# EAGLE design Uzebox Game Console Omega (EAGLE 9.6.2)
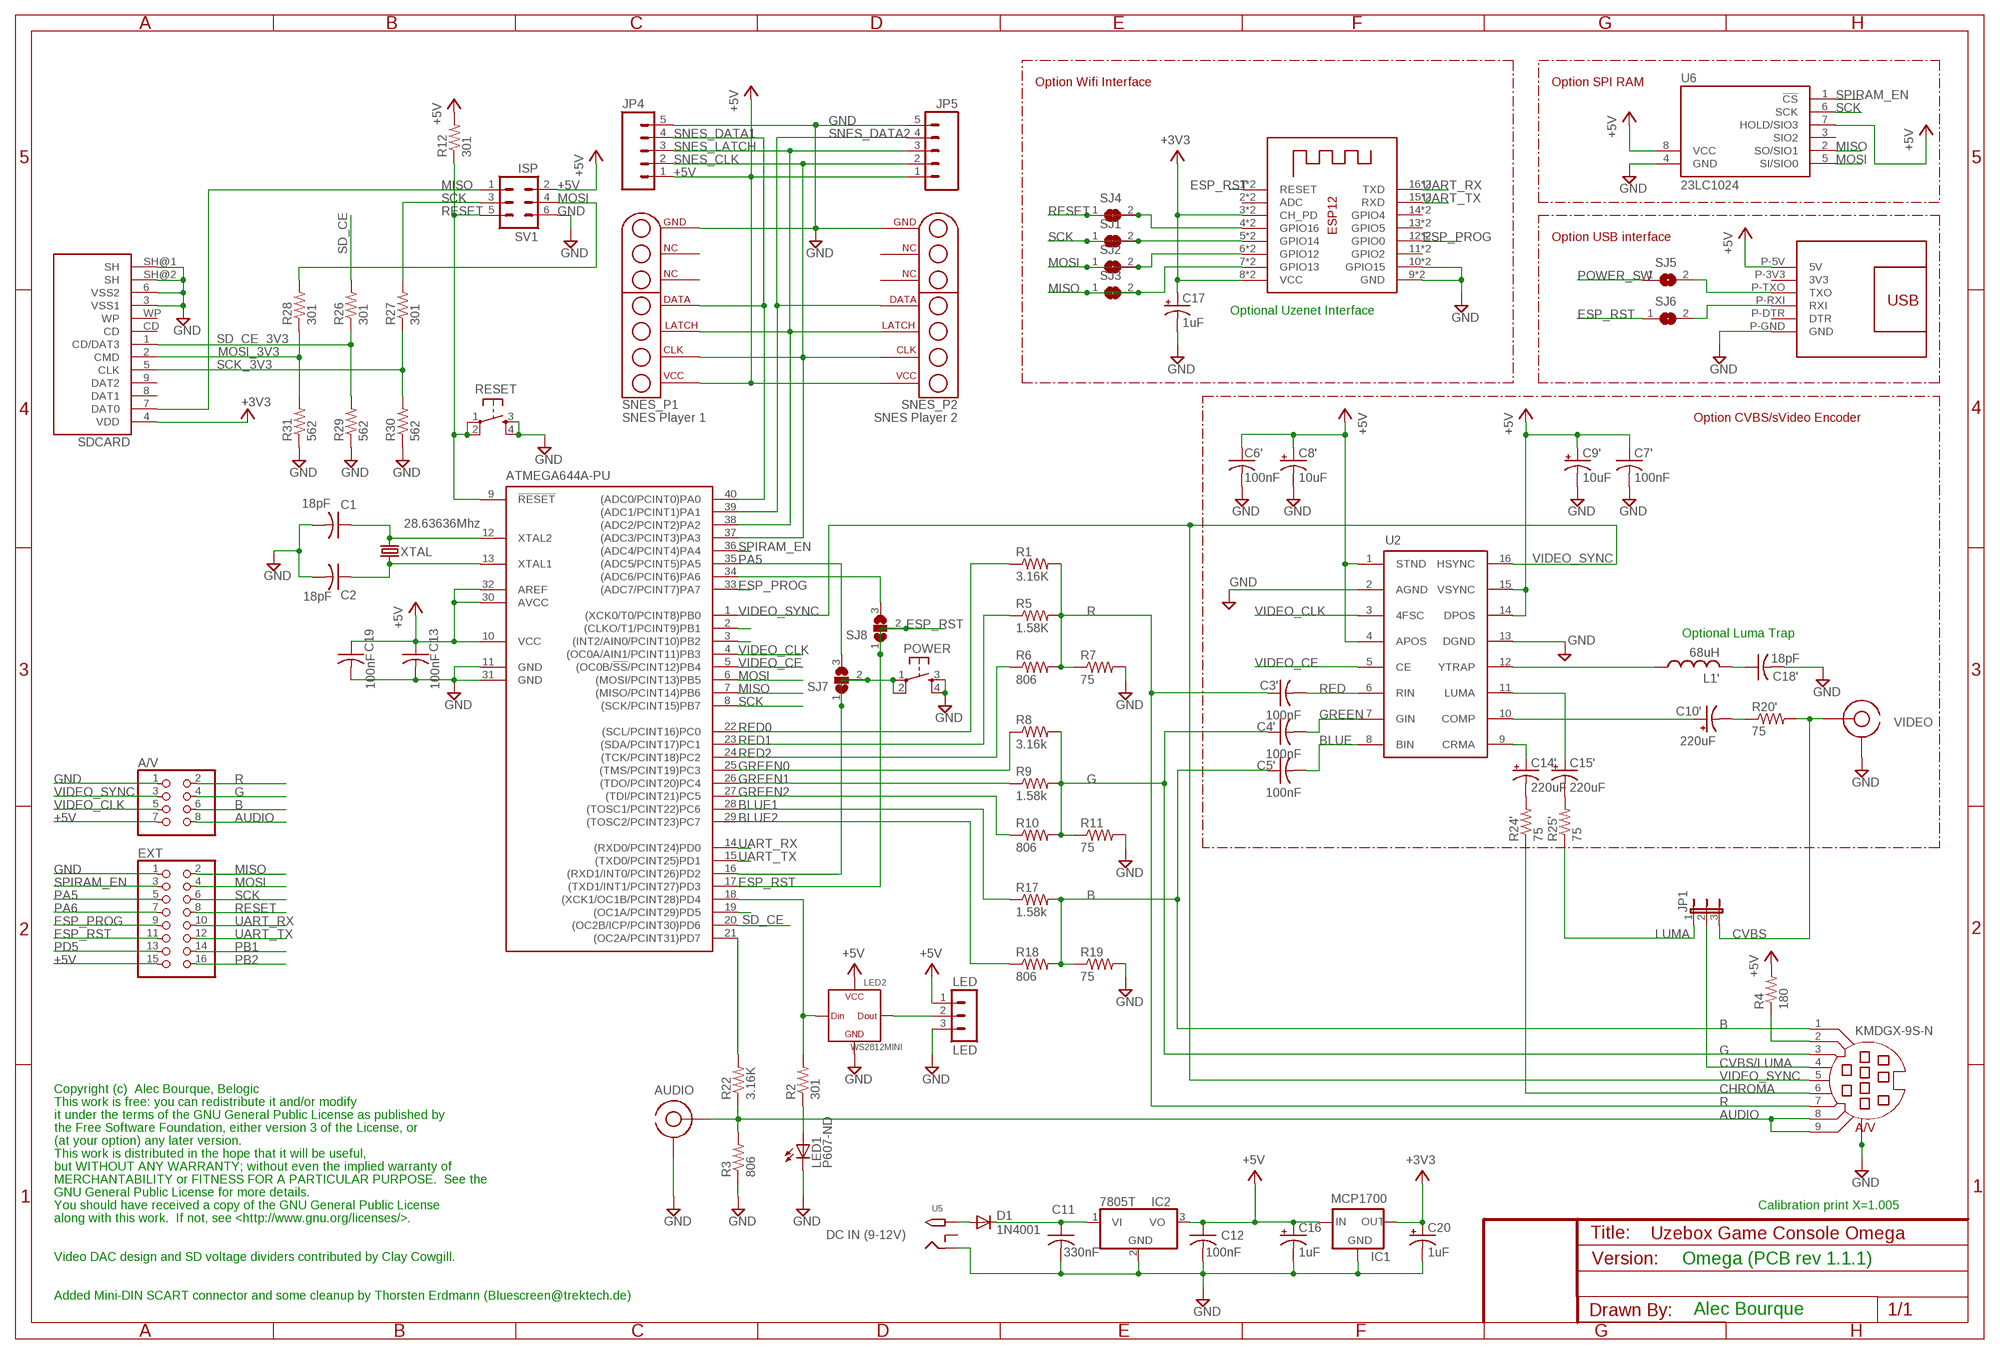
[diagram p0: schematic, sheet 1]

## Parts
A/V  PINHD-2X4  [2X04]
AD725  AD725  [SO16W]
ATMEGA644A-PU  MEGA164P/324P/644P-PU  [DIL40]
AUDIO  RCA  [RCA]
C1  18pF  C-US025-025X050  [C025-025X050]
C2  18pF  C-US025-025X050  [C025-025X050]
C3'  100nF  C-US025-025X050  [C025-025X050]
C4'  100nF  C-US025-025X050  [C025-025X050]
C5'  100nF  C-US025-025X050  [C025-025X050]
C6'  100nF  C-US025-025X050  [C025-025X050]
C7'  100nF  C-US025-025X050  [C025-025X050]
C8'  10uF  CPOL-USE2.5-6  [E2,5-6]
C9'  10uF  CPOL-USE2.5-6  [E2,5-6]
C10'  220uF  CPOL-USE2.5-6  [E2,5-6]
C11  330nF  C-US025-025X050  [C025-025X050]
C12  100nF  C-US025-025X050  [C025-025X050]
C13  100nF  C-US025-025X050  [C025-025X050]
C14'  220uF  CPOL-USE2.5-6  [E2,5-6]
C15'  220uF  CPOL-USE2.5-6  [E2,5-6]
C16  1uF  CPOL-USE2.5-6  [E2,5-6]
C17  1uF  CPOL-USE2-4  [E2-4]
C18'  18pF  C-US025-025X050  [C025-025X050]
C19  100nF  C-US025-025X050  [C025-025X050]
C20  1uF  CPOL-USE2.5-6  [E2,5-6]
CON1  USBSERIALSMD  [USBSERIAL_SMD]
D1  1N4001  1N4004  [DO41-10]
ESP-12  ESP-12  UZEBOX_ESP-12TROUGH_HOLE  [UZEBOX_ESP-12_TH]
EXT  PINHD-2X8  [2X08]
IC1  MCP1700  MCP1700INLINE  [TO92-INLINE]
IC2  7805T  [TO220H]
JP1  JP2E  [JP2]
JP4  M05PTH  [1X05]
JP5  M05PTH  [1X05]
KMDGX-9S-N  A/V  MINI-DIN-9  [MINI-DIN-9]
L1'  68uH  L-US6000-XXX-RC  [6000-XXXX-RC]
LED  LED  PINHEAD1X3  [PINHEAD1X3]
LED1  P607-ND  LED3MM  [LED3MM]
LED2  WS2812MINI  [RGB3535]
POWER  USER  TAC_SWITCHPTH  [TACTILE-PTH]
R1  3.16K  R-US_0207/10  [0207/10]
R2  301  R-US_0207/10  [0207/10]
R3  806  R-US_0207/10  [0207/10]
R4  180  R-US_0207/10  [0207/10]
R5  1.58K  R-US_0207/10  [0207/10]
R6  806  R-US_0207/10  [0207/10]
R7  75  R-US_0207/10  [0207/10]
R8  3.16k  R-US_0207/10  [0207/10]
R9  1.58k  R-US_0207/10  [0207/10]
R10  806  R-US_0207/10  [0207/10]
R11  75  R-US_0207/10  [0207/10]
R12  301  R-US_0207/10  [0207/10]
R17  1.58k  R-US_0207/10  [0207/10]
R18  806  R-US_0207/10  [0207/10]
R19  75  R-US_0207/10  [0207/10]
R20'  75  R-US_0207/10  [0207/10]
R22  3.16K  R-US_0207/10  [0207/10]
R24'  75  R-US_0207/10  [0207/10]
R25'  75  R-US_0207/10  [0207/10]
R26  301  R-US_0207/10  [0207/10]
R27  301  R-US_0207/10  [0207/10]
R28  301  R-US_0207/10  [0207/10]
R29  562  R-US_0207/10  [0207/10]
R30  562  R-US_0207/10  [0207/10]
R31  562  R-US_0207/10  [0207/10]
RESET  RESET  TAC_SWITCHPTH  [TACTILE-PTH]
SDCARD  SD_CARD_SOCKET4UCON  [SDCARD_4UCONN]
SJ1  SJ  [SJ]
SJ2  SJ  [SJ]
SJ3  SJ  [SJ]
SJ4  SJ  [SJ]
SJ5  SJ  [SJ]
SJ6  SJ  [SJ]
SJ7  SJ2W  [SJ_2]
SJ8  SJ2W  [SJ_2]
SNES_P1  SNES Player 1  SNES_CONNECTOR  [SNES_CONNECTOR]
SNES_P2  SNES Player 2  SNES_CONNECTOR  [SNES_CONNECTOR]
SV1  ISP  ML6L  [ML6L]
U5  DC IN  2.1MMJACKTHM  [PJ-102A]
U6  23LC1024  [DIL08]
VIDEO  RCA  [RCA]
XTAL  28.63636Mhz  CRYSTALHC49S  [HC49/S]

## Nets
+3V3: C17.+ C20.+ ESP-12.3(CH_PD) ESP-12.8(VCC) ESP-12.P$3(CH_PD) ESP-12.P$8(VCC) IC1.3(OUT) SDCARD.4(VDD)
+5V: A/V.7 AD725.1(STND) AD725.4(APOS) AD725.14(DPOS) AD725.15(VSYNC) ATMEGA644A-PU.10(VCC) ATMEGA644A-PU.30(AVCC) ATMEGA644A-PU.32(AREF) C6'.1 C7'.1 C8'.+ C9'.+ C12.1 C13.1 C16.+ C19.1 CON1.P-5V(5V) EXT.15 IC1.2(IN) IC2.3(VO) JP4.1 JP5.1 LED2.VSS(VCC) LED.1 R4.2 R12.2 SNES_P1.P$8(VCC) SNES_P2.P$8(VCC) SV1.2 U6.7(HOLD/SIO3) U6.8(VCC)
AUDIO: A/V.8 AUDIO.SIG KMDGX-9S-N.8 KMDGX-9S-N.9 R3.2 R22.1
B: A/V.6 C5'.1 KMDGX-9S-N.1 R17.2 R18.2 R19.1
BLUE: AD725.8(BIN) C5'.2
BLUE1: ATMEGA644A-PU.28((TOSC1/PCINT22)PC6) R17.1
BLUE2: ATMEGA644A-PU.29((TOSC2/PCINT23)PC7) R18.1
CHROMA: KMDGX-9S-N.6 R24'.1
CVBS: JP1.3 R20'.2 VIDEO.SIG
CVBS/LUMA: JP1.2 KMDGX-9S-N.4
ESP_PROG: ATMEGA644A-PU.33((ADC7/PCINT7)PA7) ESP-12.12(GPIO0) ESP-12.P$12(GPIO0) EXT.9
ESP_RST: ATMEGA644A-PU.17((TXD1/INT1/PCINT27)PD3) ESP-12.1(RESET) ESP-12.P$1(RESET) EXT.11 SJ6.1 SJ8.1 SJ8.2
G: A/V.4 C4'.1 KMDGX-9S-N.3 R8.2 R9.2 R10.2 R11.1
GND: A/V.1 AD725.2(AGND) AD725.13(DGND) ATMEGA644A-PU.11(GND) ATMEGA644A-PU.31(GND) AUDIO.GND C1.2 C2.2 C6'.2 C7'.2 C8'.- C9'.- C11.2 C12.2 C13.2 C16.- C17.- C18'.2 C19.2 C20.- CON1.P-GND(GND) ESP-12.9(GND) ESP-12.10(GPIO15) ESP-12.P$9(GND) ESP-12.P$10(GPIO15) EXT.1 IC1.1(GND) IC2.2(GND) JP4.5 JP5.5 KMDGX-9S-N.G1 KMDGX-9S-N.G2 KMDGX-9S-N.G3 LED1.K(C) LED2.VDD(GND) LED.3 POWER.3 POWER.4 R3.1 R7.2 R11.2 R19.2 R29.1 R30.1 R31.1 RESET.3 RESET.4 SDCARD.3(VSS1) SDCARD.6(VSS2) SDCARD.SH@1(SH) SDCARD.SH@2(SH) SNES_P1.P$14(GND) SNES_P2.P$14(GND) SV1.6 U5.RING U6.4(GND) VIDEO.GND
GREEN: AD725.7(GIN) C4'.2
GREEN0: ATMEGA644A-PU.25((TMS/PCINT19)PC3) R8.1
GREEN1: ATMEGA644A-PU.26((TDO/PCINT20)PC4) R9.1
GREEN2: ATMEGA644A-PU.27((TDI/PCINT21)PC5) R10.1
LUMA: JP1.1 R25'.1
MISO: ATMEGA644A-PU.7((MISO/PCINT14)PB6) ESP-12.7(GPIO13) ESP-12.P$7(GPIO13) EXT.2 SDCARD.7(DAT0) SJ3.1 SJ3.2 SV1.1 U6.2(SO/SIO1)
MOSI: ATMEGA644A-PU.6((MOSI/PCINT13)PB5) ESP-12.6(GPIO12) ESP-12.P$6(GPIO12) EXT.4 R28.2 SJ2.1 SJ2.2 SV1.4 U6.5(SI/SIO0)
MOSI_3V3: R28.1 R31.2 SDCARD.2(CMD)
N$1: AD725.12(YTRAP) L1'.1
N$2: C18'.1 L1'.2
N$3: CON1.P-TXO(TXO) SJ5.2
N$4: CON1.P-RXI(RXI) SJ6.2
N$5: LED2.DOUT LED.2
N$6: C10'.- R20'.1
N$7: AD725.10(COMP) C10'.+
N$9: ATMEGA644A-PU.12(XTAL2) C1.1 XTAL.2
N$10: D1.A U5.TIP
N$11: C14'.- R24'.2
N$12: ATMEGA644A-PU.13(XTAL1) C2.1 XTAL.1
N$13: ATMEGA644A-PU.21((OC2A/PCINT31)PD7) R22.2
N$15: KMDGX-9S-N.2 R4.1
N$20: C11.1 D1.C IC2.1(VI)
N$23: ATMEGA644A-PU.18((XCK1/OC1B/PCINT28)PD4) LED2.DIN R2.2
N$25: LED1.A R2.1
N$26: C15'.- R25'.2
N$28: AD725.11(LUMA) C15'.+
N$29: AD725.9(CRMA) C14'.+
PA5: ATMEGA644A-PU.35((ADC5/PCINT5)PA5) EXT.5 SJ7.3
PA6: ATMEGA644A-PU.34((ADC6/PCINT6)PA6) EXT.7 SJ8.3
PB1: ATMEGA644A-PU.2((CLKO/T1/PCINT9)PB1) EXT.14
PB2: ATMEGA644A-PU.3((INT2/AIN0/PCINT10)PB2) EXT.16
PD5: ATMEGA644A-PU.19((OC1A/PCINT29)PD5) EXT.13
POWER_SW: ATMEGA644A-PU.16((RXD1/INT0/PCINT26)PD2) POWER.1 POWER.2 SJ5.1 SJ7.1 SJ7.2
R: A/V.2 C3'.1 KMDGX-9S-N.7 R1.2 R5.2 R6.2 R7.1
RED: AD725.6(RIN) C3'.2
RED0: ATMEGA644A-PU.22((SCL/PCINT16)PC0) R1.1
RED1: ATMEGA644A-PU.23((SDA/PCINT17)PC1) R5.1
RED2: ATMEGA644A-PU.24((TCK/PCINT18)PC2) R6.1
RESET: ATMEGA644A-PU.9(!RESET) ESP-12.4(GPIO16) ESP-12.P$4(GPIO16) EXT.8 R12.1 RESET.1 RESET.2 SJ4.1 SJ4.2 SV1.5
SCK: ATMEGA644A-PU.8((SCK/PCINT15)PB7) ESP-12.5(GPIO14) ESP-12.P$5(GPIO14) EXT.6 R27.2 SJ1.1 SJ1.2 SV1.3 U6.6(SCK)
SCK_3V3: R27.1 R30.2 SDCARD.5(CLK)
SD_CE: ATMEGA644A-PU.20((OC2B/ICP/PCINT30)PD6) R26.2
SD_CE_3V3: R26.1 R29.2 SDCARD.1(CD/DAT3)
SNES_CLK: ATMEGA644A-PU.37((ADC3/PCINT3)PA3) JP4.2 JP5.2 SNES_P1.P$9(CLK) SNES_P2.P$9(CLK)
SNES_DATA1: ATMEGA644A-PU.40((ADC0/PCINT0)PA0) JP4.4 SNES_P1.P$11(DATA)
SNES_DATA2: ATMEGA644A-PU.39((ADC1/PCINT1)PA1) JP5.4 SNES_P2.P$11(DATA)
SNES_LATCH: ATMEGA644A-PU.38((ADC2/PCINT2)PA2) JP4.3 JP5.3 SNES_P1.P$10(LATCH) SNES_P2.P$10(LATCH)
SPIRAM_EN: ATMEGA644A-PU.36((ADC4/PCINT4)PA4) EXT.3 U6.1(!CS)
UART_RX: ATMEGA644A-PU.14((RXD0/PCINT24)PD0) ESP-12.16(TXD) ESP-12.P$16(TXD) EXT.10
UART_TX: ATMEGA644A-PU.15((TXD0/PCINT25)PD1) ESP-12.15(RXD) ESP-12.P$15(RXD) EXT.12
VIDEO_CE: AD725.5(CE) ATMEGA644A-PU.5((OC0B/!SS!/PCINT12)PB4)
VIDEO_CLK: A/V.5 AD725.3(4FSC) ATMEGA644A-PU.4((OC0A/AIN1/PCINT11)PB3)
VIDEO_SYNC: A/V.3 AD725.16(HSYNC) ATMEGA644A-PU.1((XCK0/T0/PCINT8)PB0) KMDGX-9S-N.5
Unconnected: CON1.P-3V3(3V3) CON1.P-DTR(DTR) ESP-12.2(ADC) ESP-12.11(GPIO2) ESP-12.13(GPIO5) ESP-12.14(GPIO4) ESP-12.P$2(ADC) ESP-12.P$11(GPIO2) ESP-12.P$13(GPIO5) ESP-12.P$14(GPIO4) SDCARD.8(DAT1) SDCARD.9(DAT2) SDCARD.CD SDCARD.WP SNES_P1.P$12(NC1) SNES_P1.P$13(NC2) SNES_P2.P$12(NC1) SNES_P2.P$13(NC2) U5.RING_SW U6.3(SIO2)

## Notes on the sheet
- Option Wifi Interface | Option SPI RAM
- Option USB interface
- Optional Uzenet Interface
- Option CVBS/sVideo Encoder
- Optional Luma Trap
- Copyright (c)  Alec Bourque, Belogic
- This work is free: you can redistribute it and/or modify
- it under the terms of the GNU General Public License as published by
- the Free Software Foundation, either version 3 of the License, or
- (at your option) any later version.
- This work is distributed in the hope that it will be useful,
- but WITHOUT ANY WARRANTY; without even the implied warranty of
- MERCHANTABILITY or FITNESS FOR A PARTICULAR PURPOSE.  See the
- GNU General Public License for more details.
- You should have received a copy of the GNU General Public License | Calibration print X=1.005
- along with this work.  If not, see <http://www.gnu.org/licenses/>.
- Video DAC design and SD voltage dividers contributed by Clay Cowgill.
- Omega (PCB rev 1.1.1)
- Added Mini-DIN SCART connector and some cleanup by Thorsten Erdmann (Bluescreen@trektech.de)
- Alec Bourque

## Library data of the parts
A/V = pinhead:PINHD-2X4: PIN HEADER
AD725 = ad725:AD725; IC_NO: U2
ATMEGA644A-PU = avr-5:MEGA164P/324P/644P-PU
AUDIO = rca:RCA: RCA jack; PN: CP-1420-ND
C1 C2 C6' C7' C11-C13 C18' C19 = resistor:C-US: CAPACITOR, American symbol
C3' C4' C5' = rcl:C-US: CAPACITOR, American symbol; SPICEPREFIX: C
C8' C9' C10' C14' C15' C16 C20 = rcl:CPOL-US: POLARIZED CAPACITOR, American symbol; SPICEPREFIX: C
C17 = adafruit:CPOL-US: POLARIZED CAPACITOR, American symbol
CON1 = Thorsten_diverses:USBSERIAL
D1 = adafruit:1N4004: DIODE General purpose 1N400x type rectifier (With bigger pads) http://www.ladyada.net/library/pcb/eaglelibrary.html; PN: 641-1310-1-ND
ESP-12 = Uzebox Portable V2:UZEBOX_ESP-12
EXT = pinhead:PINHD-2X8: PIN HEADER
IC1 = adafruit:MCP1700: VOLTAGE REGULATOR; DPN: MCP1700-3302E/TO-ND
IC2 = adafruit:78*: Positive VOLTAGE REGULATOR Added bigger pads to the TO-92 package; DPN: LM7805ACT-ND
JP1 = jumper:JP2E: JUMPER
JP4 JP5 = SparkFun:M05: Header 5 Standard 5-pin 0.1" header. Use with straight break away headers (SKU : PRT-00116), right angle break away headers (PRT-00553), swiss pins (PRT-00743), machine pins (PRT-00117), and female headers (PRT-00115). Molex polarized connector foot print use with SKU : PRT-08230 with associated crimp pins and housings.
KMDGX-9S-N = Thorsten_connectors:MINI-DIN-9
L1' = rcl:L-US: INDUCTOR, American symbol; SPICEPREFIX: L
LED = Thorsten_connectors:PINHEAD1X3
LED1 = adafruit:LED: LED OSRAM: - CHIPLED LG R971, LG N971, LY N971, LG Q971, LY Q971, LO R971, LY R971 LH N974, LH R974 LS Q976, LO Q976, LY Q976 LO Q996 - Hyper CHIPLED LW Q18S LB Q993, LB Q99A, LB R99A - SideLED LS A670, LO A670, LY A670, LG A670, LP A670 LB A673, LV A673, LT A673, LW A673 LH A674 LY A675 LS A676, LA A676, LO A676, LY A676, LW A676 LS A679, LY A679, LG A679 - Hyper Micro SIDELED® LS Y876, LA Y876, LO Y876, LY Y876 LT Y87S - SmartLED LW L88C, LW L88S LB L89C, LB L89S, LG L890 LS L89K, LO L89K, LY L89K LS L896, LA L896, LO L896, LY L896 - TOPLED LS T670, LO T670, LY T670, LG T670, LP T670 LSG T670, LSP T670, LSY T670, LOP T670, LYG T670 LG T671, LOG T671, LSG T671 LB T673, LV T673, LT T673, LW T673 LH T674 LS T676, LA T676, LO T676, LY T676, LB T676, LH T676, LSB T676, LW T676 LB T67C, LV T67C, LT T67C, LS T67K, LO T67K, LY T67K, LW E67C LS E67B, LA E67B, LO E67B, LY E67B, LB E67C, LV E67C, LT E67C LW T67C LS T679, LY T679, LG T679 LS T770, LO T770, LY T770, LG T770, LP T770 LB T773, LV T773, LT T773, LW T773 LH T774 LS E675, LA E675, LY E675, LS T675 LS T776, LA T776, LO T776, LY T776, LB T776 LHGB T686 LT T68C, LB T68C - Hyper Mini TOPLED® LB M676 - Mini TOPLED Santana® LG M470 LS M47K, LO M47K, LY M47K Source: http://www.osram.convergy.de/
LED2 = Thorsten_LEDs:WS2812MINI
POWER RESET = SparkFun:TAC_SWITCH: Momentary Switch Button commonly used for reset or general input. Spark Fun Electronics SKU : COM-00097; PN: P8006S-ND
R1-R12 R17-R19 R20' R22 R24' R25' R26-R31 = resistor:R-US_: RESISTOR, American symbol
SDCARD = SparkFun-Connectors:SD_CARD_SOCKET: SD Memory Card Connector, push-push normal type, CD enable, WP enable
SJ1-SJ6 = jumper:SJ: SMD solder JUMPER
SJ7 SJ8 = jumper:SJ2W: SMD solder JUMPER
SNES_P1 SNES_P2 = snes:SNES_CONNECTOR: Generic SNES connector
SV1 = con-ml:ML6L: HARTING; OC_FARNELL: unknown; OC_NEWARK: unknown
U5 = adafruit:2.1MMJACK: 2.1mm x 5.5mm THM DC jack with internal switch. Digikey part #PJ-102A, 4UCON part #05537 2.1mm x 5.5mm SMT DC jack with internal switch. Digikey part #PJ-002A-SMT, 4UCON part #03267 By microbuilder.eu & adafruit.com; LABEL: DC IN (9-12V)
U6 = uzebox:23LC1024: 1Mbit SPI Serial SRAM with SDI and SQI Interface
VIDEO = rca:RCA: RCA jack; PN: CP-1421-ND
XTAL = crystal:CRYSTAL: CRYSTAL; OC_FARNELL: 1667008; OC_NEWARK: unknown; PN: 887-1256-ND

## Board
V1.3.0: Added Uzenet interface. ESP-12 and SPI RAM. V1.3.1: Fix for ESP-12. Added missing routing between GND and GPIO15. V1.3.2: Fix for SPI RAM instability. Connected pin7 (/HOLD) to VCC.
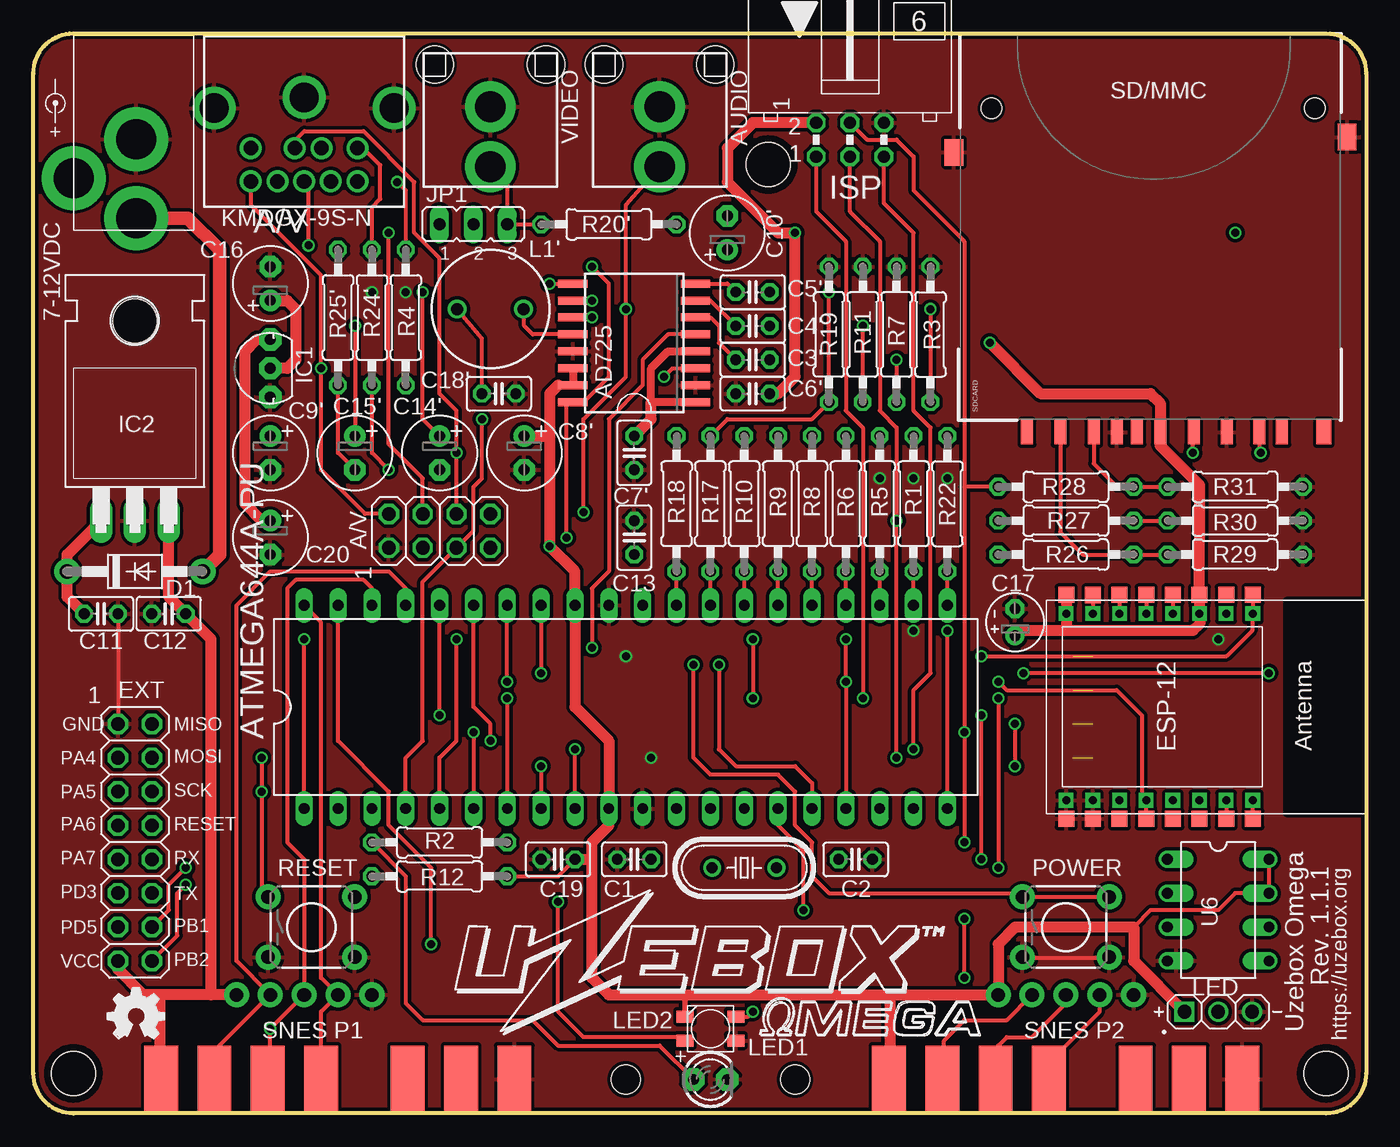
[diagram p1: board, top side]
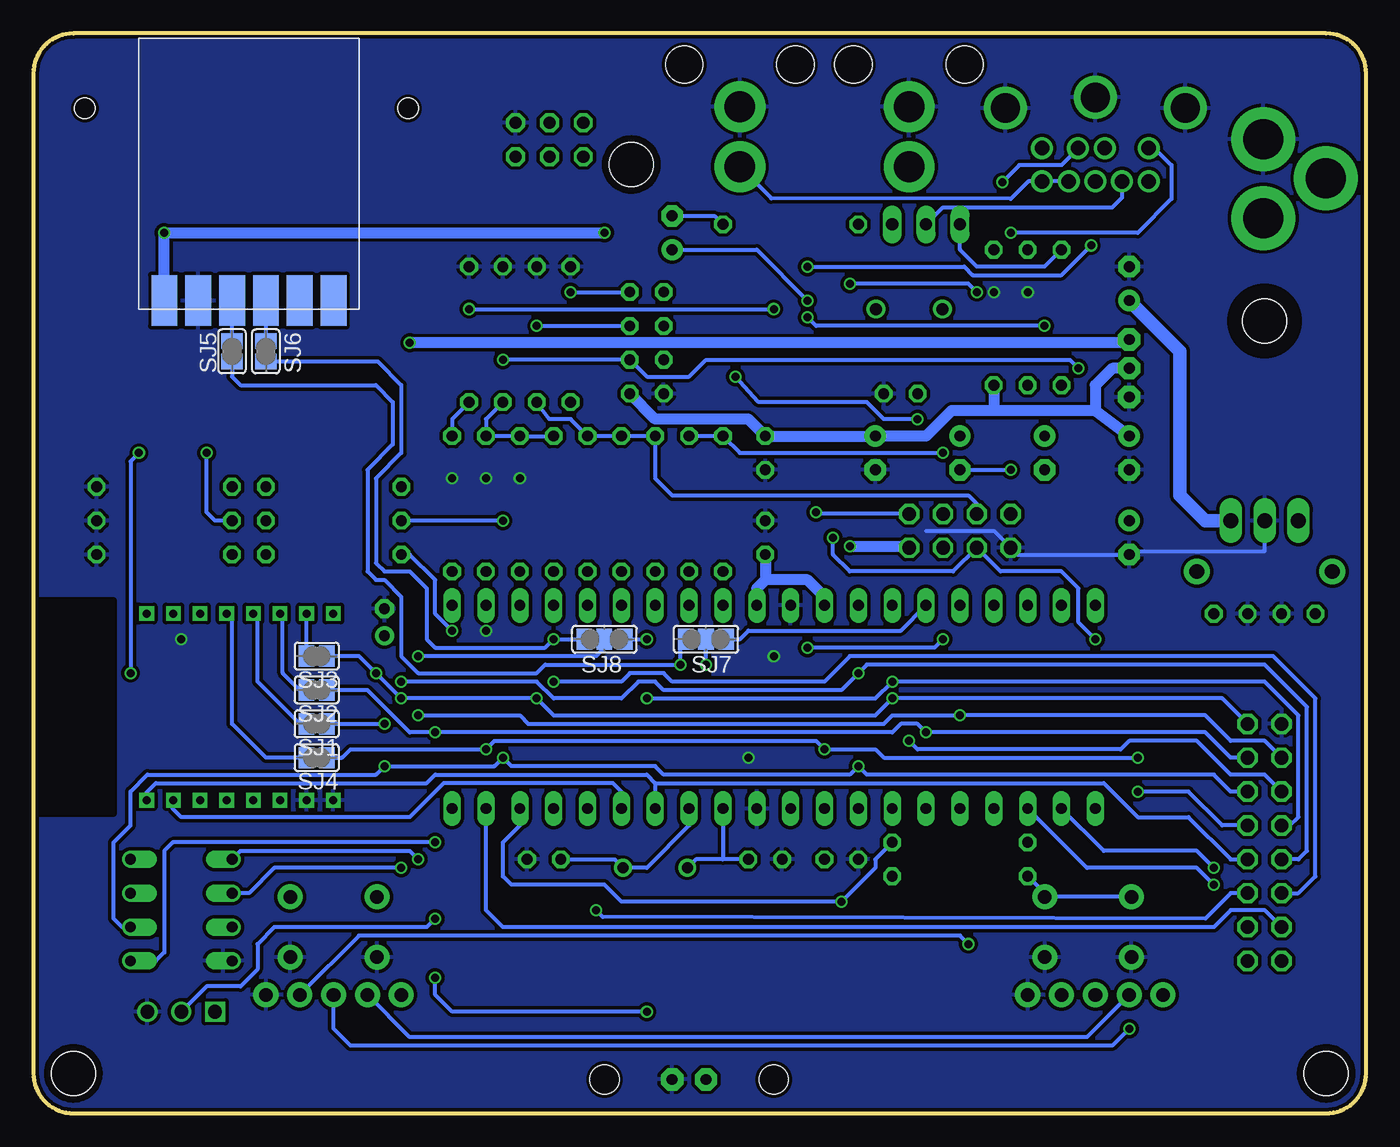
[diagram p2: board, bottom side, seen from below]

Size 100 x 81 mm. Coordinates in mm from the lower left corner, seen from the top.
Outline: 3,0 arc-90 0,3 0,78 arc-90 3,81 97,81 arc-90 100,78 100,3 arc-90 97,0 3,0
Copper layers (1*16): Top 0.035mm / dielectric 1.5mm / Bottom 0.035mm
Design rules "ITEADstudio_DRC *": minimum track width 6mil, minimum drill 12mil, track to track 6mil, track to pad 6mil, pad to pad 6mil, via to via 6mil, smd to smd 0mil, copper to edge 10mil, drill to drill 10mil, minimum pad ring 10mil, minimum via ring 6mil, stop-mask expansion 2mil, vias tented up to drill 100mil, thermal gap 10mil
Holes 2.2 mm at 44.45,2.54 57.15,2.54

### Footprints (pad centres in the part's own frame; a part is rotated, then mirrored left to right if it is on the bottom)
2X04 = drill 1.016 octagon: 1 -3.81,-1.27; 2 -3.81,1.27; 3 -1.27,-1.27; 4 -1.27,1.27; 5 1.27,-1.27; 6 1.27,1.27; 7 3.81,-1.27; 8 3.81,1.27
SO16W = smd 0.6 x 2.2: 1 -4.445,-4.6; 2 -3.175,-4.6; 3 -1.905,-4.6; 4 -0.635,-4.6; 5 0.635,-4.6; 6 1.905,-4.6; 7 3.175,-4.6; 8 4.445,-4.6; 9 4.445,4.6; 10 3.175,4.6; 11 1.905,4.6; 12 0.635,4.6; 13 -0.635,4.6; 14 -1.905,4.6; 15 -3.175,4.6; 16 -4.445,4.6
DIL40 = drill 0.813 long: 1 -24.13,-7.62; 2 -21.59,-7.62; 3 -19.05,-7.62; 4 -16.51,-7.62; 5 -13.97,-7.62; 6 -11.43,-7.62; 7 -8.89,-7.62; 8 -6.35,-7.62; 9 -3.81,-7.62; 10 -1.27,-7.62; 11 1.27,-7.62; 12 3.81,-7.62; 13 6.35,-7.62; 14 8.89,-7.62; 15 11.43,-7.62; 16 13.97,-7.62; 17 16.51,-7.62; 18 19.05,-7.62; 19 21.59,-7.62; 20 24.13,-7.62; 21 24.13,7.62; 22 21.59,7.62; 23 19.05,7.62; 24 16.51,7.62; 25 13.97,7.62; 26 11.43,7.62; 27 8.89,7.62; 28 6.35,7.62; 29 3.81,7.62; 30 1.27,7.62; 31 -1.27,7.62; 32 -3.81,7.62; 33 -6.35,7.62; 34 -8.89,7.62; 35 -11.43,7.62; 36 -13.97,7.62; 37 -16.51,7.62; 38 -19.05,7.62; 39 -21.59,7.62; 40 -24.13,7.62
RCA = drill 2.3 pad 3.81: GND 0,0; SIG 0,-4.5 | hole 2.8: -4.175,3.15; 4.175,3.15
C025-025X050 = drill 0.813 octagon: 1 -1.27,0; 2 1.27,0
E2,5-6 = drill 0.813 pad 1.6: + -1.27,0 | drill 0.813 pad 1.6 octagon: - 1.27,0
E2-4 = drill 0.813 pad 1.422: + -1.016,0 | drill 0.813 pad 1.422 octagon: - 1.016,0
USBSERIAL_SMD = smd 3.81 x 1.93: P-3V3 0,0; P-5V 0,12.7; P-DTR 0,2.54; P-GND 0,10.16; P-RXI 0,5.08; P-TXO 0,7.62
DO41-10 = drill 1.118 pad 1.93: A 5.08,0; C -5.08,0
UZEBOX_ESP-12_TH = smd 1.2 x 1.2: 1 -8.4,4.5; 2 -8.4,2.5; 3 -8.4,0.5; 4 -8.4,-1.5; 5 -8.4,-3.5; 6 -8.4,-5.5; 8 -8.4,-9.5; 9 8.4,-9.5; 10 8.4,-7.5; 11 8.4,-5.5; 12 8.4,-3.5; 13 8.4,-1.5; 14 8.4,0.5; 15 8.4,2.5; 16 8.4,4.5 | smd 1.22 x 1.2: 7 -8.4,-7.5 | drill 0.6 square: P$1 -7,4.5; P$2 -7,2.5; P$3 -7,0.5; P$4 -7,-1.5; P$5 -7,-3.5; P$6 -7,-5.5; P$7 -7,-7.5; P$8 -7,-9.5; P$9 7,-9.5; P$10 7,-7.5; P$11 7,-5.5; P$12 7,-3.5; P$13 7,-1.5; P$14 7,0.5; P$15 7,2.5; P$16 7,4.5
2X08 = drill 1.016 octagon: 1 -8.89,-1.27; 2 -8.89,1.27; 3 -6.35,-1.27; 4 -6.35,1.27; 5 -3.81,-1.27; 6 -3.81,1.27; 7 -1.27,-1.27; 8 -1.27,1.27; 9 1.27,-1.27; 10 1.27,1.27; 11 3.81,-1.27; 12 3.81,1.27; 13 6.35,-1.27; 14 6.35,1.27; 15 8.89,-1.27; 16 8.89,1.27
TO92-INLINE = drill 0.813 pad 1.676 octagon: 1 -2.159,0; 2 0,0; 3 2.159,0
TO220H = drill 1.118 long: 1 -2.54,-10.16; 2 0,-10.16; 3 2.54,-10.16 | hole 3.302: 0,4.826
JP2 = drill 0.914 long: 1 -2.54,0; 2 0,0; 3 2.54,0
1X05 = drill 1.016 pad 1.88: 1 0,0; 2 2.54,0; 3 5.08,0; 4 7.62,0; 5 10.16,0
MINI-DIN-9 = drill 1.1: 1 0.7,8.5; 2 -1.3,8.5; 3 4,8.5; 4 2,11; 5 0,11; 6 -4,8.5; 7 4,11; 8 -2,11; 9 -4,11 | drill 2.2: G1 0,4.7; G2 -6.75,5.5; G3 6.75,5.5
6000-XXXX-RC = drill 0.9 pad 1.422: 1 -2.5,0; 2 2.5,0
PINHEAD1X3 = drill 1.016 square: 1 -2.54,0 | drill 1.016: 2 0,0; 3 2.54,0
LED3MM = drill 0.813 pad 1.676 octagon: A -1.27,0; K 1.27,0
RGB3535 = smd 1.27 x 0.9: DIN 1.905,0.9; DOUT -1.905,-0.9; VDD -1.905,0.9; VSS 1.905,-0.9
TACTILE-PTH = drill 1.016 pad 1.88: 1 -3.251,2.261; 2 3.251,2.261; 3 -3.251,-2.261; 4 3.251,-2.261
0207/10 = drill 0.813 octagon: 1 -5.08,0; 2 5.08,0
SDCARD_4UCONN = smd 1.8 x 0.9: 1 -1,6.77; 2 -1,4.27; 3 -1,2.52; 4 -1,-0.73; 5 -1,-3.23; 6 -1,-5.73; 7 -1,-8.15; 8 -1,-9.85; 9 -1,9.27; CD -1,1.02 | smd 2 x 1.4: SH@1 20,14.75; SH@2 21.15,-14.75 | smd 1.8 x 1.1: WP -1,-13 | hole 1.55: 23.3,11.94; 23.3,-12.32
SJ = smd 1.168 x 1.6: 1 -0.762,0; 2 0.762,0
SJ_2 = smd 1.168 x 1.6: 1 -1.524,0; 2 0,0; 3 1.524,0
SNES_CONNECTOR = smd 2.54 x 5.08: P$8 -12,2.54; P$9 -8,2.54; P$10 -4,2.54; P$11 0,2.54; P$12 6.5,2.54; P$13 10.5,2.54; P$14 14.5,2.54
ML6L = drill 0.914 octagon: 1 -2.54,-1.27; 2 -2.54,1.27; 3 0,-1.27; 4 0,1.27; 5 2.54,-1.27; 6 2.54,1.27
PJ-102A = drill 3 pad 4.8: RING 0.1,-3.39; RING_SW -4.6,-6.29; TIP 0.1,-9.29
DIL08 = drill 0.813 offset: 1 -5.08,-5.08; 2 -2.54,-5.08; 3 0,-5.08; 4 2.54,-5.08; 5 2.54,2.54; 6 0,2.54; 7 -2.54,2.54; 8 -5.08,2.54
STAND-OFF = hole 3.302: 0,0
HC49/S = drill 0.813: 1 -2.413,0; 2 2.413,0

### Placement (x,y rotation side)
A/V  30.48,43.69 0 top
AD725  45.09,57.78 90 top
ATMEGA644A-PU  44.45,30.48 0 top
AUDIO  46.99,75.5 0 top
C1  45.09,19.05 180 top
C2  61.69,19.05 0 top
C3'  53.98,56.52 180 top
C4'  53.98,59.05 180 top
C5'  53.98,61.59 180 top
C6'  53.98,53.98 180 top
C7'  45.09,49.53 270 top
C8'  36.83,49.53 270 top
C9'  17.78,49.53 270 top
C10'  52.07,66.04 90 top
C11  5.08,37.47 0 top
C12  10.16,37.47 180 top
C13  45.09,43.18 90 top
C14'  30.48,49.53 270 top
C15'  24.13,49.53 270 top
C16  17.78,62.23 90 top
C17  73.66,36.83 90 top
C18'  34.92,53.98 0 top
C19  39.37,19.05 180 top
C20  17.78,43.18 270 top
CON1  77.47,60.96 90 bottom
D1  7.62,40.64 0 top
ESP-12  87,30.48 270 top
EXT  7.62,20.32 270 top
IC1  17.78,55.88 90 top
IC2  7.62,54.61 0 top
JP1  33.02,66.67 0 top
JP4  15.24,8.89 0 top
JP5  72.39,8.89 0 top
KMDGX-9S-N  20.32,80.9 180 top
L1'  34.29,60.33 180 top
LED  88.9,7.62 0 top
LED1  50.8,2.54 0 top
LED2  50.8,6.35 180 top
POWER  77.47,13.97 0 top
R1  66.04,45.72 90 top
R2  30.48,20.32 0 top
R3  67.31,58.42 270 top
R4  27.94,59.69 270 top
R5  63.5,45.72 90 top
R6  60.96,45.72 90 top
R7  64.77,58.42 90 top
R8  58.42,45.72 90 top
R9  55.88,45.72 90 top
R10  53.34,45.72 90 top
R11  62.23,58.42 90 top
R12  30.48,17.78 0 top
R17  50.8,45.72 90 top
R18  48.26,45.72 90 top
R19  59.69,58.42 90 top
R20'  43.18,66.67 180 top
R22  68.58,45.72 270 top
R24'  25.4,59.69 270 top
R25'  22.86,59.69 270 top
R26  77.47,41.91 180 top
R27  77.47,44.45 180 top
R28  77.47,46.99 180 top
R29  90.17,41.91 180 top
R30  90.17,44.45 180 top
R31  90.17,46.99 180 top
RESET  20.86,13.97 0 top
SDCARD  83.82,52.07 90 top
SJ1  78.74,29.21 180 bottom
SJ2  78.74,31.75 180 bottom
SJ3  78.74,34.29 180 bottom
SJ4  78.74,26.67 180 bottom
SJ5  85.09,57.15 90 bottom
SJ6  82.55,57.15 90 bottom
SJ7  49.53,35.56 0 bottom
SJ8  57.15,35.56 0 bottom
SNES_P1  21.59,0 0 top
SNES_P2  76.2,0 0 top
SV1  61.28,73.03 0 top
U5  7.62,76.44 0 top
U6  90.17,13.97 270 top
U$1  [OSHW_FILLX150_NOTEXT]  5.59,5.6 0 top
U$2  [STAND-OFF]  3,3 0 top
U$3  [STAND-OFF]  97,3 180 top
U$4  [STAND-OFF]  55.14,71.15 0 top
U$6  [LOGO]  40.91,12 0 top
U$7  [POWER]  1.65,76.71 270 top
U$8  [BUMPON]  5.79,59.85 0 top
U$9  [BUMPON]  6.05,5.92 0 top
U$10  [BUMPON]  95.95,4.79 0 top
U$11  [BUMPON]  93.83,73.83 0 top
VIDEO  34.29,75.5 0 top
XTAL  53.34,18.41 180 top

### Tracks (layer width: path | path; a pad name or v marks a point on that pad's centre or on a via)
+3V3  (via drill 0.6)
  Top 0.305: 84.58,51.31 SDCARD.4 84.55,50.07 | 77.5,36.23 77.47,36.2
  Top 0.813: v71.75,57.78 75.56,53.98 83.82,53.98 84.58,53.21 84.58,51.31 | C20.+ 17.14,44.45 15.88,45.72 15.88,57.15 16.76,58.04 IC1.3 | 84.55,50.07 87.5,47.12 ESP-12.3 ESP-12.P$3 87.5,36.7 87,36.2 77.47,36.2 73.91,36.2 C17.+ | ESP-12.8 ESP-12.P$8 77.5,36.23
  Bottom 0.305: IC1.3 17.4,57.78
  Bottom 0.813: 17.4,57.78 v71.75,57.78
+5V  (via drill 0.6)
  Top 0.305: 64.26,2.54 SNES_P2.P$8 | SNES_P1.P$8 9.53,2.54 | U6.8 U6.7 90.17,16.51 88.9,15.24 83.82,15.24 82.55,13.97 | R12.2 39.37,17.78 C19.1
  Top 0.406: LED2.VSS 48.9,8.89
  Top 0.61: AD725.4 47.62,57.15 46.35,55.88 46.35,53.34 AD725.1 | 39.37,54.61 AD725.15 AD725.14
  Top 0.813: 64.26,8.89 JP5.1 72.39,12.7 73.66,13.97 82.55,13.97 82.55,11.43 LED.1 | 64.26,8.89 64.26,2.54 | 64.26,8.89 48.9,8.89 43.18,8.89 41.91,10.16 41.91,19.05 | 9.53,2.54 9.53,8.89 | 9.53,8.89 8.26,8.89 6.35,10.79 EXT.15 | IC2.3 10.16,38.73 C12.1 13.34,35.56 13.34,8.89 | C16.+ 19.05,60.96 19.68,60.33 19.68,56.52 19.05,55.88 IC1.2 | C6'.1 55.88,53.98 57.15,55.24 v57.15,66.04 55.88,66.04 52.07,69.85 52.07,72.39 53.98,74.3 SV1.2 | 38.73,50.8 v38.73,42.55 40.64,40.64 ATMEGA644A-PU.32 40.64,30.48 43.18,27.94 ATMEGA644A-PU.10 43.18,21.59 41.91,20.32 41.91,19.05 | JP4.1 13.34,8.89 | 13.34,8.89 9.53,8.89 | C19.1 41.91,19.05 | C8'.+ 38.73,50.8 | C7'.1 46.35,52.07 46.35,53.34 | 39.37,54.61 38.73,53.98 38.73,50.8
  Top 1.016: 9.4,2.54 9.53,2.54
  Bottom 0.813: C6'.1 53.34,52.07 46.35,52.07 C7'.1 C8'.+ 33.02,50.8 31.11,52.7 27.94,52.7 | 20.32,52.7 27.94,52.7 | v38.73,42.55 34.8,42.55 A/V.7 | R4.2 27.94,52.7 | ATMEGA644A-PU.32 40.64,38.73 41.91,40.01 45.09,40.01 | 45.09,40.01 45.72,39.37 ATMEGA644A-PU.30 | C9'.+ 20.32,52.7 | IC1.2 19.05,55.88 20.32,54.61 20.32,52.7 | C13.1 45.09,40.01 | CON1.P-5V v90.17,66.04 v57.15,66.04
  Bottom 1.016: IC2.3 12.06,44.45 13.97,46.35 13.97,57.15 C16.+
AUDIO  (via drill 0.6)
  Top 0.305: v67.31,60.33 R3.2 | v41.27,45.09 41.27,52.07 44.45,55.24 v44.45,60.33 44.45,68.14 AUDIO.SIG
  Bottom 0.305: KMDGX-9S-N.8 KMDGX-9S-N.9 25.35,69.9 26.67,68.58 44.62,68.63 AUDIO.SIG | A/V.8 41.15,44.96 v41.27,45.09 | v67.31,60.33 v44.45,60.33 | R3.2 68.58,52.07 R22.1
B  (via drill 0.6)
  Top 0.305: R17.2 52.07,52.07 58.42,52.07 R19.1 v59.69,61.59 | A/V.6 v31.75,49.53 31.75,52.7 30.48,53.98 30.48,64.14 28.57,66.04 28.57,69.85 24.77,73.66 20.32,73.66 19.62,72.96 KMDGX-9S-N.1
  Bottom 0.305: R17.2 R18.2 46.99,49.53 v31.75,49.53 | v59.69,61.59 C5'.1
BLUE
  Top 0.305: AD725.8 52.07,62.23 C5'.2
BLUE1
  Top 0.305: ATMEGA644A-PU.28 R17.1
BLUE2
  Top 0.305: ATMEGA644A-PU.29 R18.1
CHROMA
  Top 0.305: R24'.1 25.4,67.94 26.04,68.58 26.04,71.12 24.76,72.4 KMDGX-9S-N.6
CVBS
  Top 0.305: VIDEO.SIG 35.56,69.85 JP1.3 R20'.2
CVBS/LUMA
  Bottom 0.305: JP1.2 31.75,67.94 19.05,67.94 18.32,68.67 KMDGX-9S-N.4
ESP_PROG  (via drill 0.6)
  Top 0.305: v72.39,32.38 73.03,31.75 81.28,31.75 83.19,29.84 83.19,23.82 ESP-12.P$12 ESP-12.12 | ATMEGA644A-PU.33 v38.1,33.02
  Bottom 0.305: v72.39,32.38 62.23,32.38 60.96,31.11 55.88,31.11 54.61,32.38 53.34,32.38 52.7,31.75 39.37,31.75 v38.1,33.02 37.47,33.66 7.62,33.66 4.45,30.48 4.45,19.68 5.08,19.05 EXT.9
ESP_RST  (via drill 0.6)
  Top 0.305: ATMEGA644A-PU.17 v60.96,32.38 v60.96,35.56 | ESP-12.1 ESP-12.P$1 91.44,37.56 91.44,36.2 89.53,34.29 v71.12,34.29
  Bottom 0.305: EXT.11 5.08,16.51 3.81,17.78 3.81,31.11 6.99,34.29 38.73,34.29 40.64,32.38 52.07,32.38 52.7,33.02 55.24,33.02 55.88,32.38 v60.96,32.38 | SJ6.1 74.17,56.39 72.39,54.61 72.39,49.53 74.3,47.62 74.3,41.27 73.66,40.64 71.75,40.64 70.48,39.37 70.48,35.56 69.85,34.92 61.59,34.92 v60.96,35.56 SJ8.1 SJ8.2 57.15,34.92 57.78,34.29 v71.12,34.29
G  (via drill 0.6)
  Top 0.305: A/V.4 29.21,47.62 26.67,50.16 v26.67,66.04 | R11.1 v62.23,59.05
  Bottom 0.305: v62.23,59.05 C4'.1 | KMDGX-9S-N.3 15.88,72.4 14.61,71.12 14.61,68.58 17.14,66.04 v26.67,66.04 | R11.1 61.28,52.07 59.69,52.07 R8.2 R9.2 R10.2 53.34,47.62 52.07,46.35 29.84,46.35 29.21,45.72 A/V.4
GND  (via drill 0.6)
  Top 0.305: C11.2 EXT.1 | 17.78,53.59 IC1.1 17.78,53.85 | RESET.4 24.13,11.68 | 74.42,11.68 80.52,11.68 POWER.4 80.77,11.68 | C16.- 18.29,64.01
  Bottom 0.305: IC2.2 7.62,42.16 17.53,42.16 C20.- 26.16,41.91 A/V.1 27.94,43.69 33.02,43.69 | RESET.3 17.78,11.68 | 23.88,11.68 RESET.4
  other vias: 63.5,47.62 66.04,47.62 68.58,47.62 66.04,36.2 25.4,61.59 27.94,61.59 88.9,35.56 44.45,34.29 46.35,26.67
  pour Top (isolate 0.254): 0,78 arc-90 3,81 97,81 arc-90 100,78 100,3 arc-90 97,0 3,0 arc-90 0,3
  pour Bottom (isolate 0.254): 0,78 arc-90 3,81 97,81 arc-90 100,78 100,3 arc-90 97,0 3,0 arc-90 0,3
GREEN
  Top 0.305: AD725.7 50.8,60.96 C4'.2
GREEN0
  Top 0.305: ATMEGA644A-PU.25 R8.1
GREEN1
  Top 0.305: ATMEGA644A-PU.26 R9.1
GREEN2
  Top 0.305: ATMEGA644A-PU.27 R10.1
LUMA
  Bottom 0.305: R25'.1 24.13,63.5 29.21,63.5 30.48,64.77 JP1.1
MISO  (via drill 0.6)  (1 unrouted)
  Top 0.305: v35.56,31.11 ATMEGA644A-PU.7 | SDCARD.7 91.97,49.63 v92.08,49.53 | v62.23,31.11 62.23,51.44 60.96,52.7 60.96,65.41 58.74,67.63 SV1.1 | v72.39,31.11 v72.39,18.41 | ESP-12.7 ESP-12.P$7 | v92.71,33.02 v74.3,33.02
  Bottom 0.305: EXT.2 10.79,31.11 v35.56,31.11 36.83,29.84 60.96,29.84 v62.23,31.11 v72.39,31.11 v74.3,33.02 75.56,34.29 SJ3.1 | v72.39,18.41 81.92,18.41 83.82,16.51 U6.2 | SJ3.2 79.5,37.5 ESP-12.P$7 | v92.08,49.53 92.71,48.9 v92.71,33.02
MOSI  (via drill 0.6)  (1 unrouted)
  Top 0.305: v33.02,28.57 ATMEGA644A-PU.6 | 69.85,46.99 69.85,65.41 66.04,69.22 66.04,71.75 64.77,73.03 62.55,73.03 SV1.4 | 69.85,46.99 v69.85,28.57 v69.85,20.32 | R28.2 69.85,46.99 | ESP-12.6 ESP-12.P$6
  Bottom 0.305: EXT.4 10.16,26.67 12.06,28.57 v33.02,28.57 33.66,29.21 34.92,29.21 35.56,28.57 v69.85,28.57 71.75,28.57 74.93,31.75 SJ2.1 | U6.5 90.81,11.43 90.17,12.06 90.17,19.68 89.53,20.32 v69.85,20.32 | SJ2.2 80.01,31.75 81.28,33.02 81.28,37.28 ESP-12.P$6
MOSI_3V3
  Top 0.305: SDCARD.2 79.55,48.72 81.28,46.99 R28.1 R31.2
N$1
  Top 0.305: AD725.12 37.47,58.42 36.83,59.05 36.83,60.28 L1'.1
N$2
  Top 0.305: L1'.2 33.66,58.1 C18'.1
N$3
  Bottom 0.305: SJ5.2 CON1.P-TXO
N$4
  Bottom 0.305: SJ6.2 CON1.P-RXI
N$5  (via drill 0.6)
  Top 0.305: LED2.DOUT 53.6,7.25 v53.98,7.62 | v69.85,10.16 v69.85,14.61
  Bottom 0.305: v53.98,7.62 68.58,7.62 69.85,8.89 v69.85,10.16 | v69.85,14.61 70.48,13.97 81.92,13.97 83.19,12.7 83.19,10.79 84.45,9.53 87,9.53 LED.2
N$6
  Bottom 0.305: C10'.- 48.9,67.31 R20'.1
N$7  (via drill 0.6)
  Top 0.305: AD725.10 v41.91,60.96
  Bottom 0.305: C10'.+ 45.72,64.77 v41.91,60.96
N$9
  Bottom 0.305: C1.1 48.26,19.05 | 48.26,19.05 50.29,19.05 XTAL.2 | ATMEGA644A-PU.12 48.26,19.05
N$10
  Top 1.016: D1.A 13.97,41.91 13.97,64.77 11.59,67.15 U5.TIP
N$11  (via drill 0.6)
  Top 0.305: v26.67,48.26 25.4,49.53 R24'.2
  Bottom 0.305: C14'.- v26.67,48.26
N$12
  Bottom 0.305: C2.1 56.39,19.05 XTAL.1 53.98,18.41 50.8,21.59 ATMEGA644A-PU.13
N$13
  Top 0.305: ATMEGA644A-PU.21 R22.2
N$15  (via drill 0.6)
  Top 0.305: v27.3,69.85 27.94,69.22 R4.1
  Bottom 0.305: v27.3,69.85 26.04,71.12 22.86,71.12 21.62,72.36 KMDGX-9S-N.2
N$20
  Top 0.813: C11.1 2.54,38.73 D1.C 2.54,41.91 IC2.1
N$23  (via drill 0.6)
  Top 0.305: LED2.DIN 48.52,5.45 48.26,5.71 41.27,5.71 39.37,7.62 v39.37,15.88
  Bottom 0.305: R2.2 36.83,19.05 36.83,18.41 v39.37,15.88 55.88,15.88 57.15,17.14 64.14,17.14 64.77,17.78 64.77,20.32 63.5,21.59 ATMEGA644A-PU.18
N$25
  Top 0.305: R2.1 27.94,17.78 27.94,8.26 29.21,6.99 37.47,6.99 39.37,5.08 46.99,5.08 LED1.A
N$26
  Top 0.305: R25'.2 22.86,49.53 C15'.-
N$28  (via drill 0.6)
  Top 0.305: AD725.11 v41.91,59.69 | v24.13,59.05 C15'.+
  Bottom 0.305: v24.13,59.05 41.27,59.05 v41.91,59.69
N$29  (via drill 0.6)
  Top 0.305: C14'.+ 29.21,52.07 v29.21,61.59 | v38.73,62.23 AD725.9
  Bottom 0.305: v29.21,61.59 29.84,62.23 v38.73,62.23
PA5  (via drill 0.6)
  Top 0.305: v34.29,27.94 34.29,29.21 33.02,30.48 ATMEGA644A-PU.35
  Bottom 0.305: EXT.5 7.62,25.4 10.16,25.4 12.7,27.94 17.78,27.94 18.41,27.3 33.66,27.3 v34.29,27.94 | SJ7.3 46.99,35.56 46.35,36.2 34.92,36.2 ATMEGA644A-PU.35
PA6  (via drill 0.6)
  Top 0.305: v35.56,32.38 ATMEGA644A-PU.34 | v53.98,35.56 v53.98,31.11
  Bottom 0.305: EXT.7 5.71,21.59 5.08,22.23 5.08,29.84 7.62,32.38 v35.56,32.38 36.83,31.11 v53.98,31.11 | SJ8.3 v53.98,35.56
PB1  (via drill 0.6)
  Top 0.305: v11.43,18.41 10.16,17.14 10.16,15.24 EXT.14
  Bottom 0.305: ATMEGA644A-PU.2 19.68,19.68 12.7,19.68 v11.43,18.41
PB2  (via drill 0.6)
  Top 0.305: v11.43,17.14 10.79,16.51 10.79,13.34 EXT.16
  Bottom 0.305: ATMEGA644A-PU.3 20.95,18.41 12.7,18.41 v11.43,17.14
PD5
  Bottom 0.305: ATMEGA644A-PU.19 66.04,15.24 64.77,13.97 11.43,13.97 10.16,15.24 7.62,15.24 EXT.13
POWER_SW  (via drill 0.6)
  Top 0.305: 74.17,16.26 POWER.1 | POWER.2 80.52,16.26 74.42,16.26 POWER.1 | POWER.1 73.94,16.51 59.69,16.51 58.42,17.78 58.42,20.32 57.15,21.59 57.15,24.13 55.88,25.4 50.8,25.4 49.53,26.67 v49.53,33.66 | v51.44,33.66 51.44,27.3 52.7,26.04 57.15,26.04 58.42,24.77 ATMEGA644A-PU.16
  Bottom 0.305: SJ5.1 85.09,55.24 84.45,54.61 74.3,54.61 73.03,53.34 73.03,50.16 74.93,48.26 74.93,40.64 74.3,40.01 73.66,40.01 72.39,38.73 72.39,34.29 71.12,33.02 62.23,33.02 61.59,33.66 v51.44,33.66 51.44,35.18 SJ7.1 SJ7.2 v49.53,33.66
R  (via drill 0.6)
  Top 0.305: v64.77,56.52 R7.1 | A/V.2 24.89,44.96 21.59,48.26 v21.59,55.88 21.59,62.87 16.32,68.14 KMDGX-9S-N.7
  Bottom 0.305: R6.2 R5.2 R1.2 66.04,52.07 R7.1 | v64.77,56.52 C3'.1 53.98,55.24 50.8,55.24 49.53,56.52 22.23,56.52 v21.59,55.88
RED
  Top 0.305: C3'.2 51.44,57.78 51.44,59.05 50.8,59.69 AD725.6
RED0
  Top 0.305: ATMEGA644A-PU.22 R1.1
RED1
  Top 0.305: ATMEGA644A-PU.23 R5.1
RED2
  Top 0.305: ATMEGA644A-PU.24 R6.1
RESET  (via drill 0.6)  (1 unrouted)
  Top 0.305: v66.04,27.3 66.04,31.75 67.31,33.02 67.31,51.44 66.04,52.7 66.04,66.04 63.82,68.26 SV1.5 | RESET.1 17.14,16.51 v17.14,24.13 v17.14,26.67 | ATMEGA644A-PU.9 v40.64,27.3 | ESP-12.4 ESP-12.P$4
  Bottom 0.305: 17.53,16.26 RESET.1 17.78,16.26 23.88,16.26 RESET.2 24.11,16.49 R12.1 | EXT.8 10.79,21.59 13.34,24.13 v17.14,24.13 | v17.14,26.67 36.2,26.67 36.83,27.3 v40.64,27.3 41.27,27.94 65.41,27.94 v66.04,27.3 76.2,27.3 76.83,26.67 SJ4.1 | SJ4.2 82.55,26.67 85.09,29.21 85.09,37.09 ESP-12.P$4
SCK  (via drill 0.6)  (1 unrouted)
  Top 0.305: v38.1,26.04 ATMEGA644A-PU.8 | v64.77,26.67 v64.77,44.45 64.77,51.44 63.5,52.7 63.5,65.41 61.28,67.63 SV1.3 | v73.66,29.21 v73.66,26.04 | ESP-12.5 ESP-12.P$5
  Bottom 0.305: EXT.6 10.16,24.13 11.43,25.4 37.47,25.4 v38.1,26.04 38.73,25.4 52.7,25.4 53.34,26.04 64.14,26.04 v64.77,26.67 65.41,26.04 v73.66,26.04 74.3,25.4 91.44,25.4 92.71,24.13 92.71,21.59 93.98,20.32 93.98,14.61 93.34,13.97 U6.6 | v64.77,44.45 R27.2 | SJ1.1 v73.66,29.21 | SJ1.2 80.01,29.21 83.19,32.38 83.19,37.19 ESP-12.P$5
SCK_3V3  (via drill 0.6)
  Top 0.305: 87.12,51.05 SDCARD.5 87,51.02 v87,49.53 | R27.1 R30.2
  Bottom 0.305: R30.2 86.36,44.45 87,45.09 v87,49.53
SD_CE  (via drill 0.6)
  Top 0.305: ATMEGA644A-PU.20 v68.58,36.2
  Bottom 0.305: v68.58,36.2 69.85,37.47 69.85,40.01 71.75,41.91 R26.2
SD_CE_3V3
  Top 0.305: SDCARD.1 77.05,43.6 78.74,41.91 R26.1 R29.2
SNES_CLK
  Top 0.305: SNES_P2.P$9 68.33,2.54 68.33,5.46 69.85,6.99 73.03,6.99 JP5.2 | ATMEGA644A-PU.37 27.94,39.37 26.67,40.64 17.78,40.64 15.24,38.1 15.24,11.43 JP4.2 13.72,4.83 13.72,2.54 SNES_P1.P$9
  Bottom 0.305: JP5.2 71.75,5.71 20.95,5.71 JP4.2
SNES_DATA1
  Top 0.305: ATMEGA644A-PU.40 21.59,36.83 21.59,10.16 JP4.4 21.59,7.62 SNES_P1.P$11
SNES_DATA2  (via drill 0.6)
  Top 0.305: ATMEGA644A-PU.39 22.86,27.94 26.67,24.13 26.67,21.59 29.84,18.41 v29.84,12.7 | SNES_P2.P$11 76.2,3.81 80.01,7.62 JP5.4
  Bottom 0.305: v29.84,12.7 30.48,13.34 75.56,13.34 JP5.4
SNES_LATCH  (via drill 0.6)
  Top 0.305: SNES_P2.P$10 72.39,2.54 72.39,5.08 73.03,5.71 74.93,5.71 77.47,8.26 JP5.3 | ATMEGA644A-PU.38 25.4,39.37 24.77,40.01 19.68,40.01 19.05,39.37 19.05,20.32 20.32,19.05 JP4.3 v17.78,6.35 17.78,2.54 SNES_P1.P$10
  Bottom 0.305: v17.78,6.35 19.05,5.08 76.2,5.08 77.47,6.35 JP5.3
SPIRAM_EN  (via drill 0.6)
  Top 0.305: v30.48,29.84 ATMEGA644A-PU.36 | v71.12,19.05 v71.12,29.84
  Bottom 0.305: EXT.3 7.62,27.94 10.16,27.94 12.06,29.84 v30.48,29.84 35.56,29.84 36.2,29.21 62.87,29.21 63.5,29.84 v71.12,29.84 | U6.1 84.45,19.68 71.75,19.68 v71.12,19.05
UART_RX
  Top 0.305: 91.5,22.03 ESP-12.16 ESP-12.P$16
  Bottom 0.305: 53.34,24.77 ATMEGA644A-PU.14 | ESP-12.P$16 91.5,24.07 90.81,24.77 70.48,24.77 69.85,25.4 53.98,25.4 53.34,24.77 | 53.34,24.77 19.68,24.77 17.14,22.23 13.34,22.23 10.16,19.05 EXT.10
UART_TX  (via drill 0.6)
  Top 0.305: ATMEGA644A-PU.15 55.88,21.59 57.78,19.68 v57.78,15.24 | 89.53,23.54 ESP-12.P$15 ESP-12.15
  Bottom 0.305: v57.78,15.24 57.28,14.73 12.06,14.61 10.16,16.51 EXT.12 | ESP-12.P$15 89.53,23.54 89.53,22.86 88.9,22.23 71.75,22.23 69.22,24.77 56.52,24.77 55.88,24.13 ATMEGA644A-PU.15
VIDEO_CE  (via drill 0.6)
  Top 0.305: v31.75,35.56 31.75,27.94 30.48,26.67 ATMEGA644A-PU.5 | AD725.5 47.62,58.42 45.72,56.52 45.72,54.61 43.18,52.07 43.18,40.64 41.91,39.37 v41.91,34.92
  Bottom 0.305: v31.75,35.56 32.38,34.92 v41.91,34.92
VIDEO_CLK  (via drill 0.6)
  Top 0.305: v33.66,52.07 33.66,47.62 33.02,46.99 33.02,43.69 A/V.5 29.21,39.88 29.21,27.94 27.94,26.67 ATMEGA644A-PU.4 | v47.31,55.24 47.94,55.88 AD725.3
  Bottom 0.305: v47.31,55.24 45.59,53.34 37.47,53.34 36.2,52.07 v33.66,52.07
VIDEO_SYNC  (via drill 0.6)
  Top 0.305: ATMEGA644A-PU.1 v20.32,35.56 | v41.91,63.5 43.18,62.23 43.18,55.24 41.27,53.34 AD725.16 40.01,53.34 v40.01,43.18 | v20.64,65.09 20.64,69.58 KMDGX-9S-N.5
  Bottom 0.305: v20.32,35.56 21.59,36.83 21.59,39.37 22.86,40.64 27.43,40.64 A/V.3 30.99,40.64 38.73,40.64 40.01,41.91 v40.01,43.18 | v41.91,63.5 30.16,63.5 29.53,62.87 22.86,62.87 v20.64,65.09

### Text on the board
tPlace: SD/MMC | 1 | ISP | A/V | 7-12VDC | 1 | 1 | 1 | GND | MISO | PA4 | MOSI | PA5 | SCK | PA6 | RESET | PA7 | RX | PD3 | TX | PB1 | PD5 | VCC | PB2 | Rev. 1.1.1 | SNES P1 | SNES P2 | Uzebox Omega | https://uzebox.org